# Altium project ECE1895_BopIt.PrjPcb
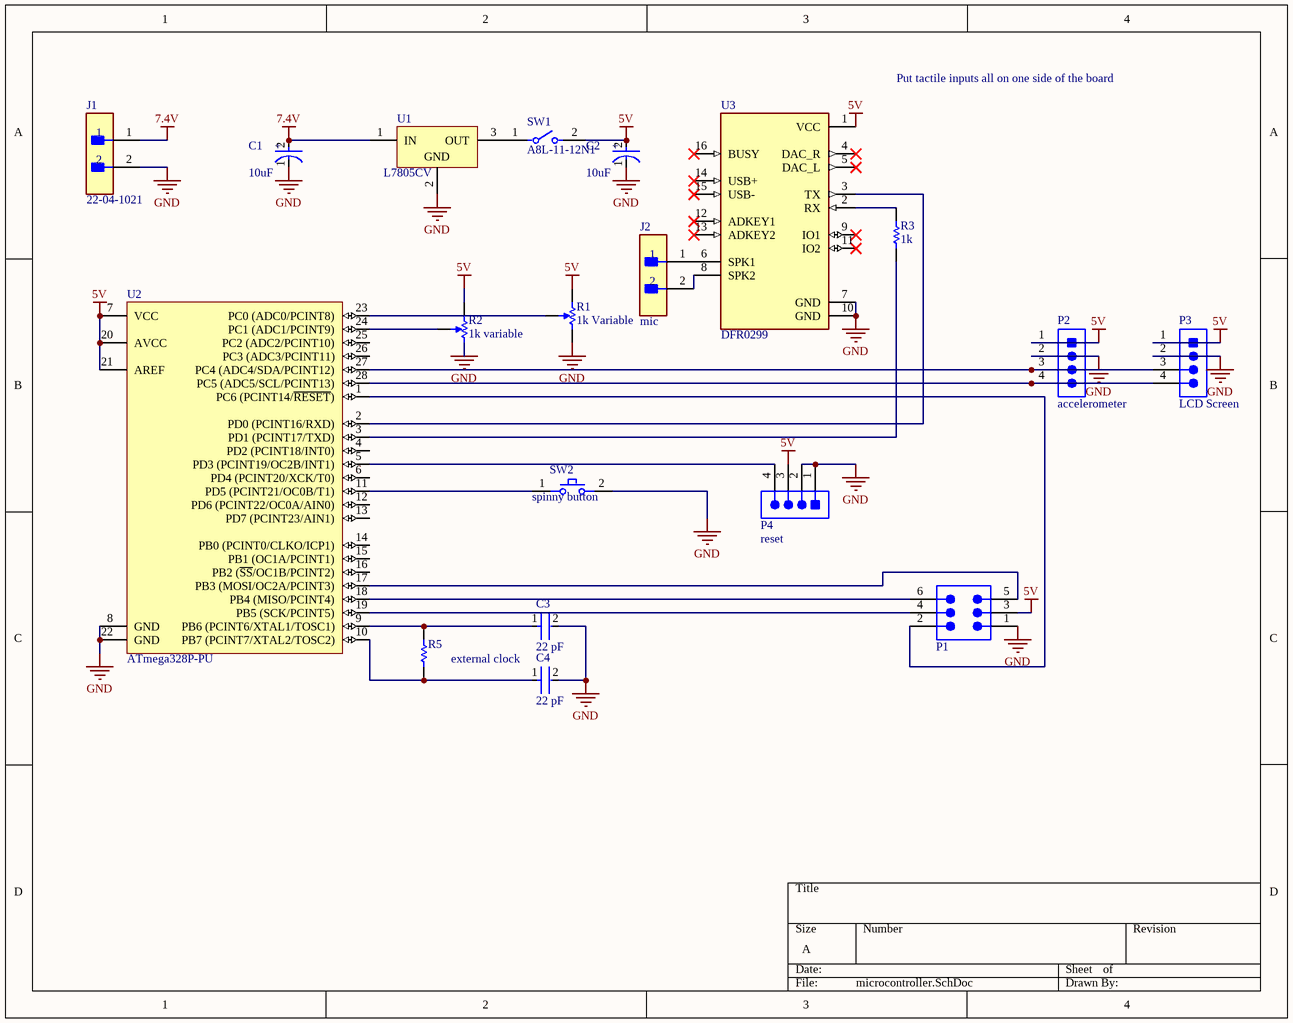
[diagram p0: microcontroller.SchDoc]
1 sheet, 19 parts. Net scope: global (net labels, ports and power ports of the same name join across sheets).

## Sheet microcontroller.SchDoc
size A; SheetNumber: 1; SheetTotal: 1

### Parts
C1  10uF  [FP-RAD-TH-D_16_0_5-L_15_1-MFG]
C2  10uF  [FP-RAD-TH-D_16_0_5-L_15_1-MFG]
C3  22 pF  [FP-DE1_D9_T4_F10_d0_6-0_0-MFG]
C4  22 pF  [FP-DE1_D9_T4_F10_d0_6-0_0-MFG]
J1  22-04-1021  [FP-22-04-1021-MFG]
J2  mic  [FP-22-04-1021-MFG]
P1  61200621621  [61200621621]  (value not drawn)
P2  accelerometer  [MOLX-22-27-2041_V]
P3  LCD Screen  [MOLX-22-27-2041_V]
P4  reset  [MOLX-22-27-2041_V]
R1  1k Variable  [BIT-93PR1KLF]
R2  1k variable  [BIT-93PR1KLF]
R3  1k  [RESA60-630X240]
R5  external clock  [RESA60-630X240]
SW1  A8L-11-12N1  [FP-A8L-11-12N1-MFG]
SW2  spinny button  [FP-B3AL-1003P-MFG]
U1  L7805CV  [TO220]
U2  ATmega328P-PU  [28P3]
U3  DFR0299  [MODULE_DFR0299]

### Nets
5V: C2.2(A) P1.3 P2.1 P3.1 P4.3 R1.1 R2.1 SW1.2 U2.7(VCC) U2.20(AVCC) U2.21(AREF) U3.1(VCC)
7.4V: C1.2(A) J1.1 U1.1(IN)
GND: C1.1(C) C2.1(C) C3.2 C4.2 J1.2 P1.1 P2.2 P3.2 P4.1 P4.2 R1.3 R2.3 SW2.2 U1.2(GND) U2.8(GND) U2.22(GND) U3.7(GND) U3.10(GND)
NetC3_1: C3.1 R5.2 U2.9(PB6_(PCINT6/XTAL1/TOSC1))
NetC4_1: C4.1 R5.1 U2.10(PB7_(PCINT7/XTAL2/TOSC2))
NetJ2_1: J2.1 U3.6(SPK1)
NetJ2_2: J2.2 U3.8(SPK2)
NetP1_2: P1.2 U2.1(PC6_(PCINT14/~{RESET}))
NetP1_4: P1.4 U2.19(PB5_(SCK/PCINT5))
NetP1_5: P1.5 U2.17(PB3_(MOSI/OC2A/PCINT3))
NetP1_6: P1.6 U2.18(PB4_(MISO/PCINT4))
NetP2_3: P2.3 P3.3 U2.27(PC4_(ADC4/SDA/PCINT12))
NetP2_4: P2.4 P3.4 U2.28(PC5_(ADC5/SCL/PCINT13))
NetP4_4: P4.4 U2.5(PD3_(PCINT19/OC2B/INT1))
NetR1_2: R1.2 U2.23(PC0_(ADC0/PCINT8))
NetR2_2: R2.2 U2.24(PC1_(ADC1/PCINT9))
NetR3_1: R3.1 U2.3(PD1_(PCINT17/TXD))
NetR3_2: R3.2 U3.2(RX)
NetSW1_1: SW1.1 U1.3(OUT)
NetSW2_1: SW2.1 U2.11(PD5_(PCINT21/OC0B/T1))
NetU2_2: U2.2(PD0_(PCINT16/RXD)) U3.3(TX)

Not connected (* = marked no-connect by the designer): U2 4(PD2_(PCINT18/INT0)) 6(PD4_(PCINT20/XCK/T0)) 12(PD6_(PCINT22/OC0A/AIN0)) 13(PD7_(PCINT23/AIN1)) 14(PB0_(PCINT0/CLKO/ICP1)) 15(PB1_(OC1A/PCINT1)) 16(PB2_(~{SS}/OC1B/PCINT2)) 25(PC2_(ADC2/PCINT10)) 26(PC3_(ADC3/PCINT11)); U3 4(DAC_R)* 5(DAC_L)* 9(IO1)* 11(IO2)* 12(ADKEY1)* 13(ADKEY2)* 14(USB+)* 15(USB-)* 16(BUSY)*

### Notes on the sheet
- Put tactile inputs all on one side of the board
- (in symbol CMP-05427-000770-1) +

### Library data of the parts
C1 C2 = CMP-05427-000770-1: Aluminum Electrolytic Capacitors (Radial Lead Type) AEC-Q200 Qualified 330uF ±20% 50V; Lead Diameter: 0.8mm; Life (Hours): 2000Hour; Ripple Current: 1.45A; Case/Package: Radial; Voltage Rating (DC): 50V; RoHS Compliant: Yes; Length: 15mm; Tolerance: 20%; Series: TA; Diameter: 16mm; Voltage Rating: 50V; Capacitance: 330uF; Packaging: Bulk; REACH SVHC: No SVHC; Max Operating Temperature: 125°C; Termination: Radial; Package Quantity: 100; Radiation Hardening: No; Height: 15mm; Lead Pitch: 7.5mm; Number of Pins: 2; Mount: Through Hole; Min Operating Temperature: -40°C
C3 C4 = CMP-06035-032365-1: Cap Ceramic Disc 2200pF 20% 250VAC Thru-Hole 9.0x4.0x10.0 Ammo pack; Lead/Base Style: Straight; Voltage Rating: 250V; Ratings: X1; Capacitance: 2.2nF; Case/Package: Radial; Packaging: Cut Tape; Max Operating Temperature: 125°C; Tolerance: 20%; Mount: Through Hole; Min Operating Temperature: -40°C
J1 J2 = CMP-04776-000257-1: CONN HEADER VERT 2POS 2.5MM; Number of Circuits: 2; Gender: Male; Insulation Resistance: 1GR; Voltage Rating (DC): 250V; Contact Post Length: 0.134inch; Glow Wire Compliant: Non-compliant; Flammability Rating: UL94 V-0; Packaging: Bulk; Contact Mating Length: 0.295inch; Weight: 0.007055oz; Lead Free: Lead Free; Fastening Type: Friction; Contact Type: -; Connector Type: Header; Contact Shape: Square; Insulation Color: Natural; Mount: Through Hole; Halogen Free: Low Halogen; Termination: Through Hole; Contact Plating: Tin; Insulation Height: 0.461inch; RoHS Compliant: Yes; Insulation Material: Nylon; Number of Positions: 2; Series: 5045; Package Quantity: 1000; Number of Rows: 1; Contact Material: Tin
P1 = 61200621621: WR-BHD Male Box Header, THT Straight, pitch 2.54mm, 2 row, 6 pin; Manufacturer: Wurth Elektronik; Contact Resistance: 20mOhm; Insulation Resistance: 1000MOhm; Rated Current: 3A; Working Voltage: 250V; Withstanding Voltage: 500V; Manufacturer Part Number: 61200621621; Category: Wire-to-Board Connectors; Match Code: WR-BHD; ComponentLink1Description: Website Link; ComponentLink1URL: https://www.we-online.com/redexpert/article/61200621621?ad; ComponentLink2Description: Datasheet Link; ComponentLink2URL: https://www.we-online.com/redexpert/spec/61200621621?ad; Mount: Through Hole; Operating Temperature Max: 105°C; Operating Temperature Min: -40°C; Packaging: Tray; Length: 15.28mm; Width: 9.1mm; Height: 9.1mm; Gender: Male; Number of Pins: 6; Number of Rows: 2; Orientation: Straight; Pitch: 2.54mm
P2-P4 = CMP-2000-05243-1: Male Header, Pitch 2.54 mm, 1 x 4 Position, Height 11.7 mm, Tail Length 3.56 mm, RoHS, Bulk; Manufacturer: Molex; Voltage rating: 250V; Current rating: 4A; Datasheet Version: Rev. F, 06/2009; Operating temperature: 0degCto+75degC; Contact material: Tinplatedbrass; Manufacturer URL: http://www.molex.com/; Housing material: Nylon(UL94V-0); Datasheet URL: http://www.molex.com/pdm_docs/sd/022272041_sd.pdf
R1 R2 = CMP-2000-05711-1: 1/2” Diameter Single Turn Cermet Trimming Potentiometer, 1 KOhm, -55 to 125 degC, 3-Pin THD, RoHS, Bulk; Manufacturer: BI Technologies; Product Diameter (mm): 12.7mm; Shaft Diameter (mm): 6.35mm; Rad Hardened: No; Resistance: 1000ohm; Product Length (mm): NotRequiredmm; Temperature Coefficient: ?100ppm/?C; Tolerance (+ or -): 10%; DELETED: Compliant; Number of Turns: 1Turn; Power Rating: 1W; Mounting Technology: ThroughHole; Product Height (mm): 6.35mm; Failure Rate: NotRequired; Datasheet Version: 12/2012; Operating Temp Range: -55Cto125C; Type: Trimmer; Manufacturer URL: http://www.bi-technologies.net/; Termination Style: Pin; Technology: Cermet; Datasheet URL: https://datasheet.ciiva.com/15760/93-15760960.pdf; Product Depth (mm): NotRequiredmm; Mounting Style: ThroughHole; Package Reference: 93PR1KLF; Package Description: 3-Pin Through Hole Device, Dia 12.7mm; Packaging: Box; Military Standard: NotRequired
R3 R5 = CMP-1659-00075-1: Axial Resistor, 1 KOhm, +/- 1%, 250 mW, -55 to 155 degC, 2-Pin THD, RoHS, Bulk; Voltage Rating: 250 V; Resistance: 10 kohm; Power Rating: 250 mW; ComponentLink2Description: Datasheet; RoHSCompliant: true; PackageReference: MFR-25; Case\Package: Axial; Max Operating Temperature: 155 degC; DatasheetVersion: Apr-13; Tolerance: 1%; ComponentLink1URL: http://www.yageo.com/; Length: 0.248 inch; ComponentLink2URL: http://www.yageo.com/documents/recent/Yageo%20LR_MFR_2013.pdf; Packaging: Bulk; Package Quantity: 200; PackageDescription: 2-Pin Axial Lead, Dia 2.4 mm, Body Length 6.3 mm; Min Operating Temperature: -55 degC; ComponentLink1Description: Manufacturer URL
SW1 = CMP-08830-000001-1: SWITCH ROCKER SPST 10A 125V; Max Voltage Rating (AC): 250V; Mechanical Life: 50000Cycles; Switch Function: On-Off; Electrical Life: 10000Cycles; Packaging: Bulk; Mount: Panel; Termination: PC Pins; Orientation: Straight; Max Operating Temperature: 55°C; Current Rating: 10A; RoHS Compliant: Yes; Throw Configuration: SPST; Min Operating Temperature: -20°C; Radiation Hardening: No; Voltage Rating (AC): 125V
SW2 = CMP-08834-000018-1: SWITCH TACTILE SPST-NO 0.05A 16V; Contact Resistance: 100mR; Illumination Type: Non-Illuminated; Electrical Life: 1000000Cycles; Switch Function: Off-Mom; Switch Travel: 1.3mm; Contact Current Rating: 50mA; Actuator Color: White; Operating Force: 3.5N; Throw Configuration: SPST; Package Quantity: 1; Orientation: Straight; Radiation Hardening: No; Packaging: Tape and Reel; Max Voltage Rating (DC): 16V; Mechanical Life: 1000000Cycles; Min Operating Temperature: -40°C; Depth: 6.6mm; Voltage Rating (DC): 16V; Contact Plating: Silver; Mount: Surface Mount; Series: B3AL; Termination: SMD/SMT; Max Current Rating: 50mA; RoHS Compliant: Yes; Max Operating Temperature: 90°C; Current Rating: 50mA; Length: 6.9mm; Weight: 0.18g
U1 = CMP-0244-00483-1: Positive Voltage Regulator, 5V, 3-Pin TO-220; PackageDescription: TO, Thru-Hole, Vertical, Heatsink Mounted; 3 In-Line Leads; Pitch 2.54 mm; ComponentLink2Description: Datasheet; PackageReference: TO220; ComponentLink3URL: http://www.st.com/internet/com/TECHNICAL_RESOURCES/TECHNICAL_LITERATURE/PACKAGE_INFORMATION/CD00004649.pdf; DatasheetVersion: 16/11/2011; ComponentLink1Description: Manufacturer URL; ComponentLink1URL: http://www.st.com; PackageVersion: ver3.0; ComponentLink3Description: Package Specification; ComponentLink2URL: http://www.st.com/internet/com/TECHNICAL_RESOURCES/TECHNICAL_LITERATURE/DATASHEET/CD00000444.pdf
U2 = CMP-0095-00013-2: 8-bit AVR Microcontroller, 32KB Flash, 1KB EEPROM, 2KB SRAM, 28-pin PDIP, Industrial Grade (-40°C to 85°C); RevisionNote: DatasheetVersion updated. URLs added.; PackageVersion: revB, Sep-2001; PackageDescription: 28-lead (0.300"/7.62mm Wide) Plastic Dual Inline Package (PDIP); DatasheetVersion: revD, May-2011; ComponentLink1Description: Manufacturer URL; ComponentLink1URL: http://www.atmel.com/; PackageReference: 28P3; ComponentLink2Description: ATmega48A/48PA/88A/88PA/168A/168PA/328/328P Datasheet; ComponentLink3URL: http://www.atmel.com/dyn/resources/prod_documents/8271S.pdf; ComponentLink2URL: http://www.atmel.com/dyn/resources/prod_documents/8271.pdf; ComponentLink3Description: ATmega48A/48PA/88A/88PA/168A/168PA/328/328P Summary
U3 = DFR0299: Dfplayer - a Mini Mp3 Player; Package: None; Price: None; Value: *; MP: DFR0299; Availability: Unavailable